# EAGLE design ICM-42605-breakout (EAGLE 9.6.1)
REVISION: 1.0; SCH_DESC: Breakout board for the LSM9DS1; TEAM: RoboCup
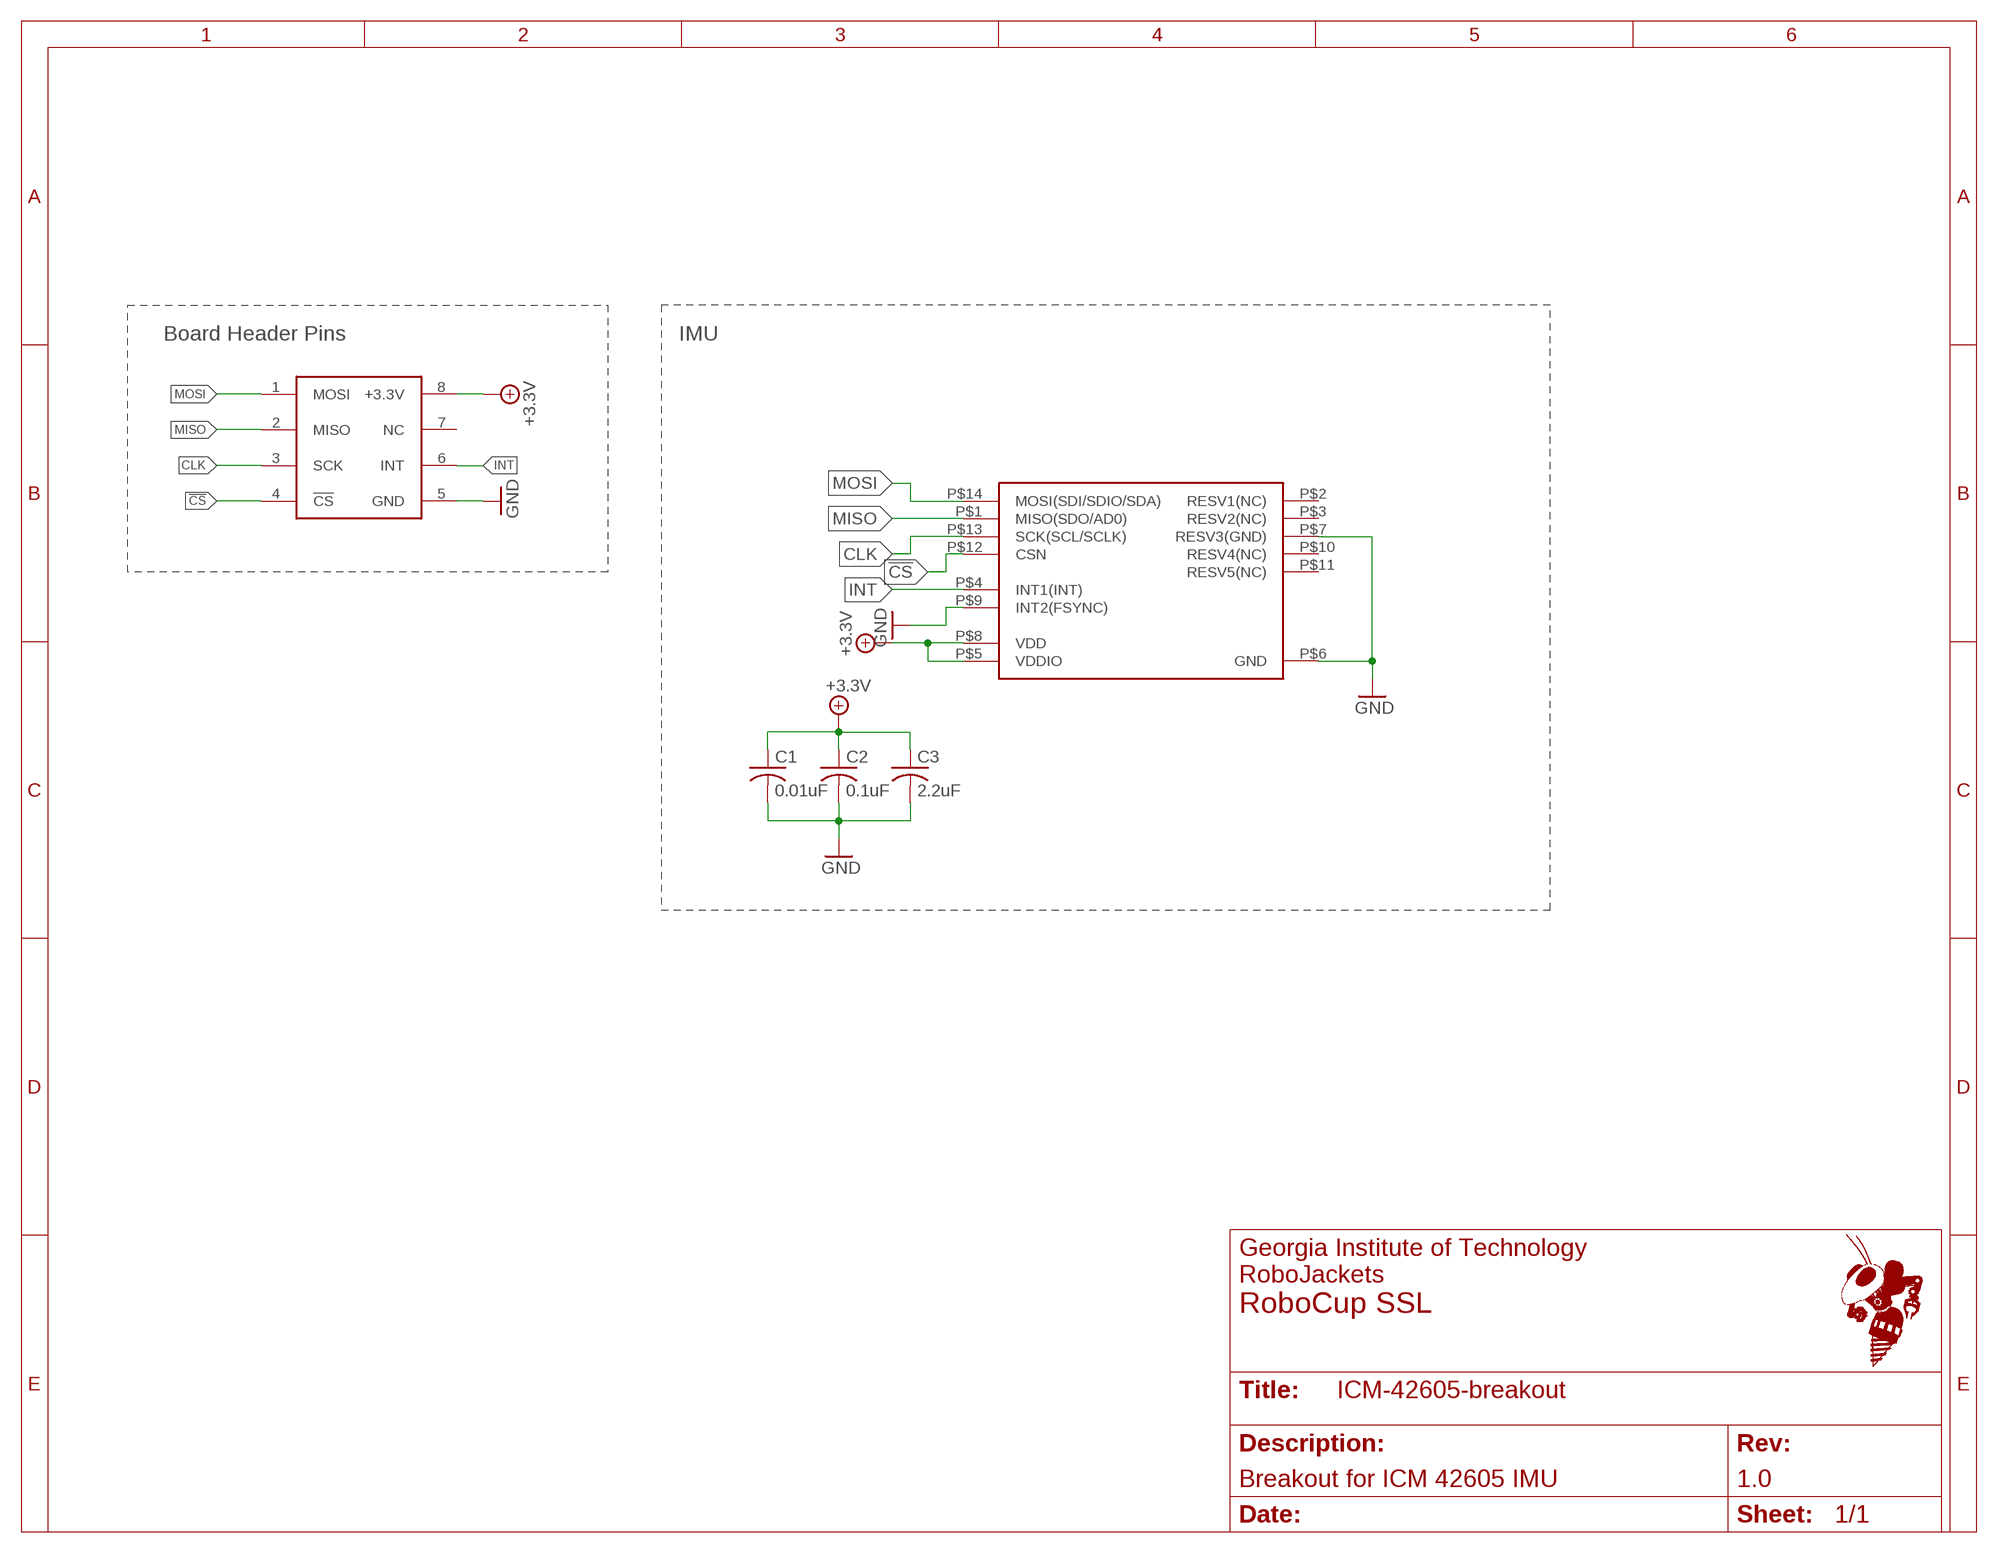
[diagram p0: schematic, sheet 1]
FRAME1 (FRAME_A_L): REVISION: 1.0; SCH_DESC: Breakout for ICM 42605 IMU; TEAM: RoboCup SSL

## Parts
C1  0.01uF  C-USC0603  [C0603]
C2  0.1uF  C-USC0603  [C0603]
C3  2.2uF  C-USC0603  [C0603]
KIT1  IMUIMU-KIT  [IMU-KIT]
U3  ICM-42605  [ICM-442605-2530091]

## Nets
!CS!: KIT1.4(!CS!) U3.P$12(CSN)
+3.3V: C1.1 C2.1 C3.1 KIT1.8(+3.3V) U3.P$5(VDDIO) U3.P$8(VDD)
CLK: KIT1.3(SCK) U3.P$13(SCK(SCL/SCLK))
GND: C1.2 C2.2 C3.2 KIT1.5(GND) U3.P$6(GND) U3.P$7(RESV3(GND)) U3.P$9(INT2(FSYNC))
INT: KIT1.6(INT) U3.P$4(INT1(INT))
MISO: KIT1.2(MISO) U3.P$1(MISO(SDO/AD0))
MOSI: KIT1.1(MOSI) U3.P$14(MOSI(SDI/SDIO/SDA))
Unconnected: KIT1.7(NC) U3.P$2(RESV1(NC)) U3.P$3(RESV2(NC)) U3.P$10(RESV4(NC)) U3.P$11(RESV5(NC))

## Notes on the sheet
- Board Header Pins | IMU

## Library data of the parts
C1-C3 = rcl:C-US: CAPACITOR, American symbol; SPICEPREFIX: C
KIT1 = RoboJackets-Boards:IMU: IMU breakout board
U3 = RoboJackets-Sensors:ICM-42605; DIGIKEY_LINK: https://www.digikey.com/product-detail/en/tdk-invensense/ICM-42605/1428-1152-1-ND/9953675; DIGIKEY_PN: 1428-1152-1-ND; MANUFACTURER: InvenSense; MPN: ICM-42605

## Board
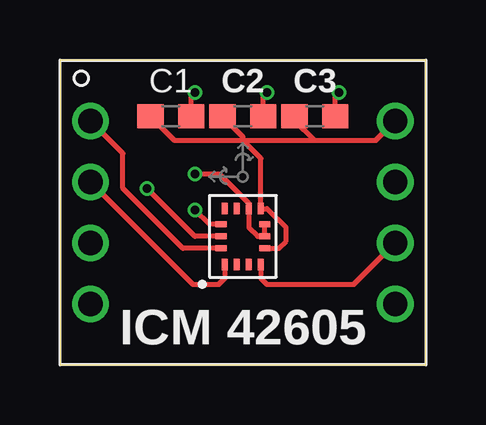
[diagram p1: board, top side]
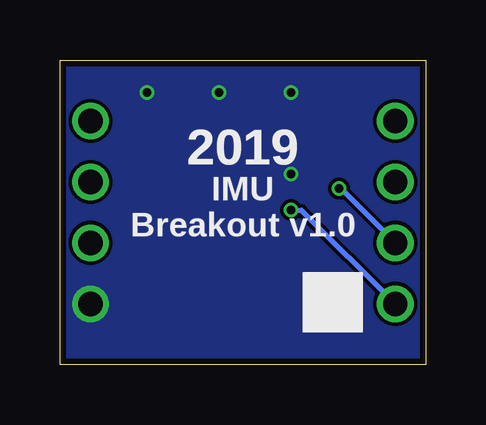
[diagram p2: board, bottom side, seen from below]

Size 15.24 x 12.7 mm. Coordinates in mm from the lower left corner, seen from the top.
Outline: 0,0 15.24,0 15.24,12.7 0,12.7 0,0
Copper layers (1*16): Top 0.018mm / dielectric 1.55mm / Bottom 0.018mm
Design rules "eC_2Layer_PClass6_BaseCopperO18_eCDefault": minimum track width 0.15mm, minimum drill 0.35mm, track to track 0.15mm, track to pad 0.15mm, pad to pad 0.15mm, via to via 0.15mm, smd to smd 0mil, copper to edge 0.25mm, drill to drill 0.35mm, minimum pad ring 0.175mm, minimum via ring 0.125mm, stop-mask expansion 0mil, vias tented up to drill 0.45mm, thermal gap 0.2mm

### Footprints (pad centres in the part's own frame; a part is rotated, then mirrored left to right if it is on the bottom)
C0603 = smd 1.1 x 1: 1 -0.85,0; 2 0.85,0
IMU-KIT = drill 1.016: 1 -6.35,3.81; 2 -6.35,1.27; 3 -6.35,-1.27; 4 -6.35,-3.81; 5 6.35,-3.81; 6 6.35,-1.27; 7 6.35,1.27; 8 6.35,3.81
ICM-442605-2530091 = smd 0.475 x 0.25: P$1 -1.163,0.75; P$2 -1.163,0.25; P$3 -1.163,-0.25; P$4 -1.163,-0.75; P$8 1.163,-0.75; P$9 1.163,-0.25; P$10 1.163,0.25; P$11 1.163,0.75 | smd 0.25 x 0.475: P$5 -0.5,-0.912; P$6 0,-0.912; P$7 0.5,-0.912; P$12 0.5,0.912; P$13 0,0.912; P$14 -0.5,0.912

### Placement (x,y rotation side)
C1  4.62,10.35 0 top
C2  7.62,10.35 0 top
C3  10.62,10.35 0 top
KIT1  7.62,6.35 0 top
U3  7.62,5.35 90 top

### Tracks (layer width: path | path; a pad name or v marks a point on that pad's centre or on a via)
!CS!  (via drill 0.35)
  Top 0.2: v5.62,6.45 6.22,5.85 U3.P$12
  Bottom 0.2: v5.62,6.45 5.18,6.45 KIT1.4
+3.3V
  Top 0.2: C1.1 4.77,9.35 7.62,9.35 | KIT1.8 13.16,9.35 10.62,9.35 | 7.62,9.35 10.62,9.35 | C2.1 7.62,9.5 7.62,9.35 | C3.1 9.77,10.2 10.62,9.35 | U3.P$5 9.12,4.85 9.42,5.15 9.42,5.71 8.62,6.51 U3.P$8 | U3.P$8 8.37,8.6 | 8.37,8.6 7.62,9.35 | U3.P$8 8.37,8.6
CLK  (via drill 0.35)
  Top 0.2: U3.P$13 5.62,5.35 | 5.62,5.35 v3.62,7.35 5.62,5.35
  Bottom 0.2: KIT1.3 3.54,7.35 | 3.54,7.35 v3.62,7.35 | KIT1.3 3.54,7.35 | KIT1.3 3.54,7.35
GND  (via drill 0.35)
  Top 0.2: U3.P$7 U3.P$6 8.23,5.35 7.87,5.71 U3.P$9 7.87,6.73 6.65,7.95 v5.62,7.95 | C3.2 11.47,11.2 v11.62,11.35 | C2.2 8.47,11.2 v8.62,11.35 | C1.2 5.47,11.2 v5.62,11.35
  pour Bottom (no thermals): 0,12.7 15.24,12.7 15.24,0 0,0
INT
  Top 0.2: U3.P$4 8.37,3.6 8.62,3.35 12.24,3.35 | 12.24,3.35 KIT1.6 | 12.24,3.35 KIT1.6 | 12.24,3.35 KIT1.6
MISO
  Top 0.2: U3.P$1 6.87,3.6 6.62,3.35 5.54,3.35 | KIT1.2 5.54,3.35 | KIT1.2 5.54,3.35 | KIT1.2 5.54,3.35
MOSI
  Top 0.2: U3.P$14 5.12,4.85 2.62,7.35 2.62,8.81 | 2.62,8.81 KIT1.1 | 2.62,8.81 KIT1.1 | 2.62,8.81 KIT1.1

### Text on the board
tPlace: ICM 42605
bPlace: 2019 | 2019 | IMU / Breakout v1.0